# Altium schematic sheet 指示灯.SchDoc
size A4
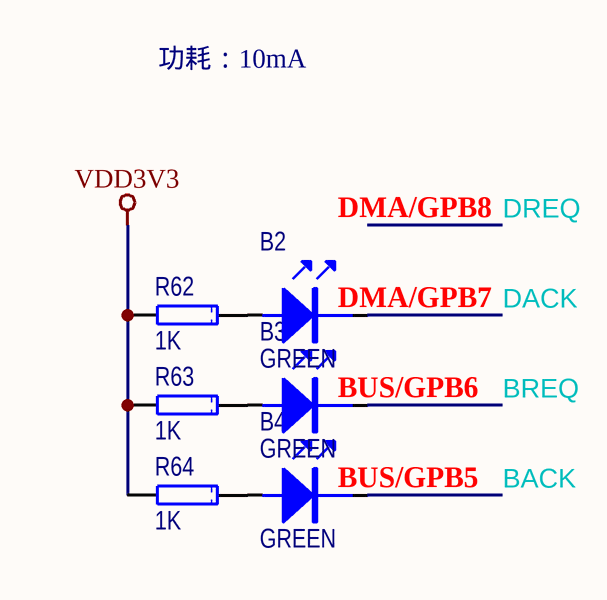
[diagram p0: 指示灯.SchDoc]

## Parts
B2  GREEN  [0805LED]
B3  GREEN  [0805LED]
B4  GREEN  [0805LED]
R62  1K  [1608[0603]R]
R63  1K  [1608[0603]R]
R64  1K  [1608[0603]R]

## Nets
VDD3V3: R62.2 R63.2 R64.2
BACK: B4.2
BREQ: B3.2
DACK: B2.2
NetB2_1: B2.1 R62.1
NetB3_1: B3.1 R63.1
NetB4_1: B4.1 R64.1

## Notes on the sheet
- 功耗：10mA
- (near B2) DMA/GPB7
- (near B2) DMA/GPB8
- (near B4) BUS/GPB5
- (near B3) BUS/GPB6

## Library data of the parts
B2-B4 = LED: 发光管
R62-R64 = RES: Manufacturer: vishay; Model: CRCW06031K0KKEDTR; Value: 1K; Type: 无铅电阻